# EAGLE design routed_anemo4 (EAGLE 6.6.0)
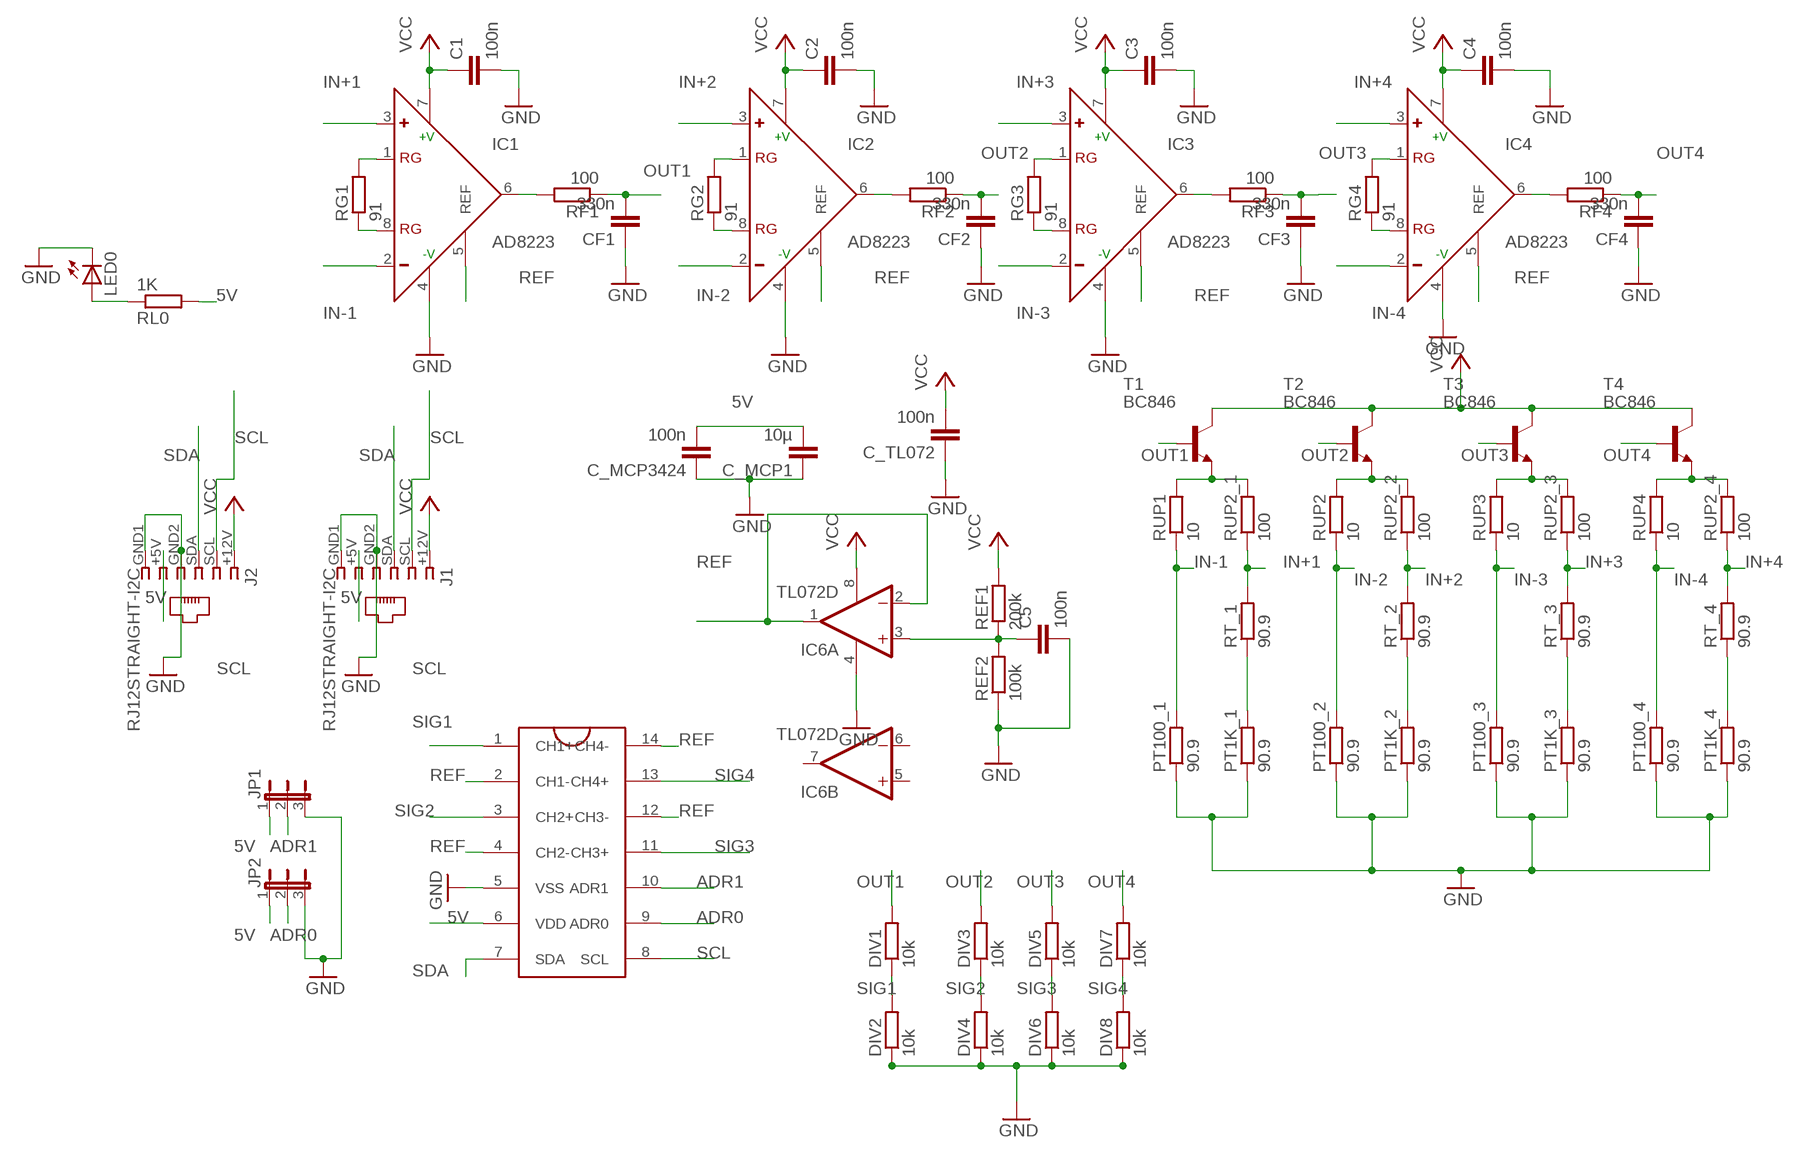
[diagram p0: schematic, sheet 1]

## Parts
C1  100n  C-EUC1206  [C1206]
C2  100n  C-EUC1206  [C1206]
C3  100n  C-EUC1206  [C1206]
C4  100n  C-EUC1206  [C1206]
C5  100n  C-EUC1206  [C1206]
C_MCP1  10µ  C-EUC1206  [C1206]
C_MCP3424  100n  C-EUC1206  [C1206]
C_TL072  100n  C-EUC1206  [C1206]
CF1  330n  C-EUC1206  [C1206]
CF2  330n  C-EUC1206  [C1206]
CF3  330n  C-EUC1206  [C1206]
CF4  330n  C-EUC1206  [C1206]
DIV1  10k  R-EU_M1206  [M1206]
DIV2  10k  R-EU_M1206  [M1206]
DIV3  10k  R-EU_M1206  [M1206]
DIV4  10k  R-EU_M1206  [M1206]
DIV5  10k  R-EU_M1206  [M1206]
DIV6  10k  R-EU_M1206  [M1206]
DIV7  10k  R-EU_M1206  [M1206]
DIV8  10k  R-EU_M1206  [M1206]
IC1  AD8223  AD620R  [SO8]
IC2  AD8223  AD620R  [SO8]
IC3  AD8223  AD620R  [SO8]
IC4  AD8223  AD620R  [SO8]
IC6  TL072D  [SO08]
J1  RJ12STRAIGHT-I2C  [RJ12-STRAIGHT-I2C]
J2  RJ12STRAIGHT-I2C  [RJ12-STRAIGHT-I2C]
JP1  JP2E  [JP2]
JP2  JP2E  [JP2]
LED0  LED1206  [LED-1206]
PT1K_1  90.9  R-EU_M1206  [M1206]
PT1K_2  90.9  R-EU_M1206  [M1206]
PT1K_3  90.9  R-EU_M1206  [M1206]
PT1K_4  90.9  R-EU_M1206  [M1206]
PT100_1  90.9  R-EU_M1206  [M1206]
PT100_2  90.9  R-EU_M1206  [M1206]
PT100_3  90.9  R-EU_M1206  [M1206]
PT100_4  90.9  R-EU_M1206  [M1206]
REF1  200k  R-EU_M1206  [M1206]
REF2  100k  R-EU_M1206  [M1206]
RF1  100  R-EU_M1206  [M1206]
RF2  100  R-EU_M1206  [M1206]
RF3  100  R-EU_M1206  [M1206]
RF4  100  R-EU_M1206  [M1206]
RG1  91  R-EU_M1206  [M1206]
RG2  91  R-EU_M1206  [M1206]
RG3  91  R-EU_M1206  [M1206]
RG4  91  R-EU_M1206  [M1206]
RL0  1K  R-EU_M1206  [M1206]
RT_1  90.9  R-EU_M1206  [M1206]
RT_2  90.9  R-EU_M1206  [M1206]
RT_3  90.9  R-EU_M1206  [M1206]
RT_4  90.9  R-EU_M1206  [M1206]
RUP1  10  R-EU_M1206  [M1206]
RUP2  10  R-EU_M1206  [M1206]
RUP2_1  100  R-EU_M1206  [M1206]
RUP2_2  100  R-EU_M1206  [M1206]
RUP2_3  100  R-EU_M1206  [M1206]
RUP2_4  100  R-EU_M1206  [M1206]
RUP3  10  R-EU_M1206  [M1206]
RUP4  10  R-EU_M1206  [M1206]
T1  BC846  [SOT23]
T2  BC846  [SOT23]
T3  BC846  [SOT23]
T4  BC846  [SOT23]
U$1  MCP3424(SO14)  [14LDSOIC]

## Nets
5V: C_MCP1.2 C_MCP3424.2 J1.+5V J2.+5V JP1.1 JP2.1 RL0.2 U$1.6(VDD)
ADR0: JP2.2 U$1.9(ADR0)
ADR1: JP1.2 U$1.10(ADR1)
GND [gnd]: C1.2 C2.2 C3.2 C4.2 C5.2 C_MCP1.1 C_MCP3424.1 C_TL072.1 CF1.1 CF2.1 CF3.1 CF4.1 DIV2.1 DIV4.1 DIV6.1 DIV8.1 IC1.4(-V) IC2.4(-V) IC3.4(-V) IC4.4(-V) IC6.4(P:V-) J1.GND1 J1.GND2 J2.GND1 J2.GND2 JP1.3 JP2.3 LED0.C PT1K_1.1 PT1K_2.1 PT1K_3.1 PT1K_4.1 PT100_1.1 PT100_2.1 PT100_3.1 PT100_4.1 REF2.1 U$1.5(VSS)
IN+1: IC1.3(+) RT_1.2 RUP2_1.1
IN+2: IC2.3(+) RT_2.2 RUP2_2.1
IN+3: IC3.3(+) RT_3.2 RUP2_3.1
IN+4: IC4.3(+) RT_4.2 RUP2_4.1
IN-1: IC1.2(-) PT100_1.2 RUP1.1
IN-2: IC2.2(-) PT100_2.2 RUP2.1
IN-3: IC3.2(-) PT100_3.2 RUP3.1
IN-4: IC4.2(-) PT100_4.2 RUP4.1
N$1: IC1.1(RG) RG1.2
N$2: IC1.8(RG) RG1.1
N$3: IC2.8(RG) RG2.1
N$4: IC2.1(RG) RG2.2
N$5: IC3.1(RG) RG3.2
N$6: IC3.8(RG) RG3.1
N$7: IC4.1(RG) RG4.2
N$8: IC4.8(RG) RG4.1
N$9: RUP1.2 RUP2_1.2 T1.2(E)
N$10: C5.1 IC6.3(A:+IN) REF1.1 REF2.2
N$11: RUP2.2 RUP2_2.2 T2.2(E)
N$12: RUP2_3.2 RUP3.2 T3.2(E)
N$13: RUP2_4.2 RUP4.2 T4.2(E)
N$14: LED0.A RL0.1
N$18: IC1.6(OUT) RF1.2
N$19: IC2.6(OUT) RF2.2
N$20: IC3.6(OUT) RF3.2
N$21: IC4.6(OUT) RF4.2
N$23: PT1K_1.2 RT_1.1
N$25: PT1K_2.2 RT_2.1
N$27: PT1K_3.2 RT_3.1
N$29: PT1K_4.2 RT_4.1
OUT1: CF1.2 DIV1.2 RF1.1 T1.1(B)
OUT2: CF2.2 DIV3.2 RF2.1 T2.1(B)
OUT3: CF3.2 DIV5.2 RF3.1 T3.1(B)
OUT4: CF4.2 DIV7.2 RF4.1 T4.1(B)
REF: IC1.5(REF) IC2.5(REF) IC3.5(REF) IC4.5(REF) IC6.1(A:OUT) IC6.2(A:-IN) U$1.2(CH1-) U$1.4(CH2-) U$1.12(CH3-) U$1.14(CH4-)
SCL: J1.SCL J2.SCL U$1.8(SCL)
SDA: J1.SDA J2.SDA U$1.7(SDA)
SIG1: DIV1.1 DIV2.2 U$1.1(CH1+)
SIG2: DIV3.1 DIV4.2 U$1.3(CH2+)
SIG3: DIV5.1 DIV6.2 U$1.11(CH3+)
SIG4: DIV7.1 DIV8.2 U$1.13(CH4+)
VCC: C1.1 C2.1 C3.1 C4.1 C_TL072.2 IC1.7(+V) IC2.7(+V) IC3.7(+V) IC4.7(+V) IC6.8(P:V+) J1.+12V J2.+12V REF1.2 T1.3(C) T2.3(C) T3.3(C) T4.3(C)
Unconnected: IC6.5(B:+IN) IC6.6(B:-IN) IC6.7(B:OUT)

## Library data of the parts
C1-C5 C_MCP1 C_MCP3424 C_TL072 CF1-CF4 = rcl:C-EU: CAPACITOR, European symbol
DIV1-DIV8 PT1K_1-PT1K_4 PT100_1-PT100_4 REF1 REF2 RF1-RF4 RG1-RG4 RL0 RT_1-RT_4 RUP1 RUP2 RUP2_1-RUP2_4 RUP3 RUP4 = resistor:R-EU_: RESISTOR, European symbol
IC1-IC4 = analog-devices:AD620: Low Cost, Low Power, Instrumentation Amplifier Source: http://www.analog.com/UploadedFiles/Data_Sheets/37793330023930AD620_e.pdf; MPN: AD620AR; OC_FARNELL: 1464424; OC_NEWARK: 05F7109
IC6 = linear:TL072: OP AMP
J1 J2 = lpatiny:RJ12: CORCOM Modular RJ Jacks No Shield Source: www.tycoelectronics.com .. ENG_DS_1654001_1099_RJ_L_0507.pdf
JP1 JP2 = jumper:JP2E: JUMPER
LED0 = SparkFun:LED: LEDs Standard schematic elements and footprints for 5mm, 3mm, 1206, and 0603 sized LEDs. 5mm - Spark Fun Electronics SKU : COM-00529 (and others)
T1-T4 = transistor:BC846: NPN TRANSISTOR
U$1 = mcp3424:MCP3424(SO14)

## Net classes
0 default: width 0.61 mm
1 gnd: width 0.61 mm
2 highpower: width 1.372 mm

## Board
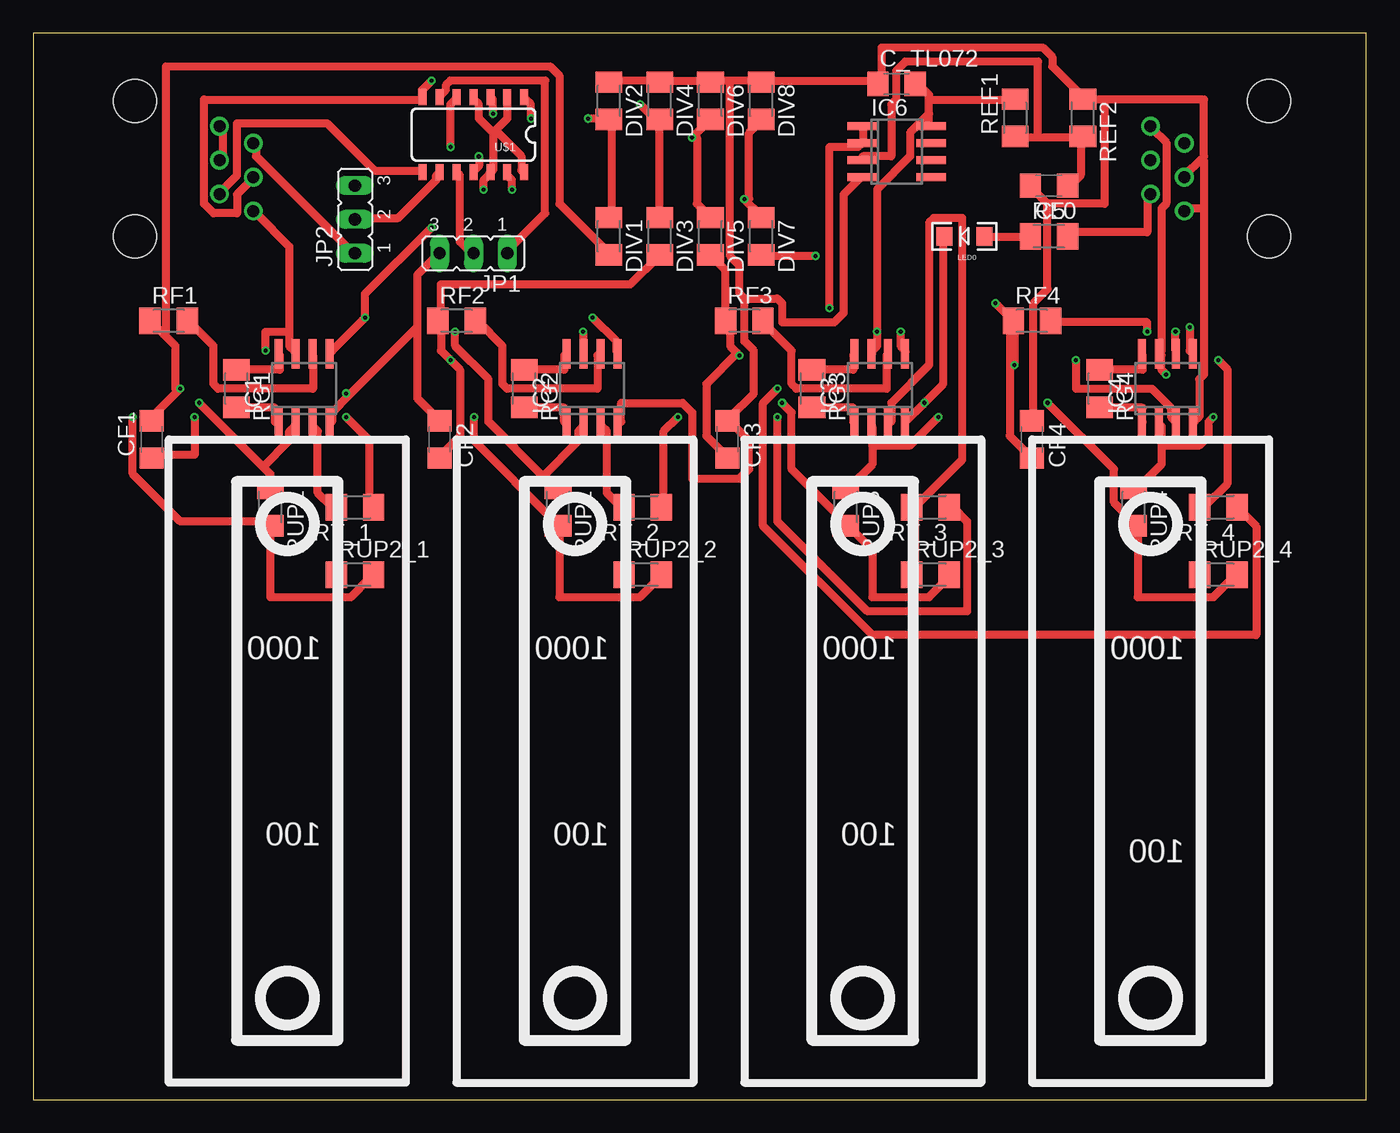
[diagram p1: board, top side]
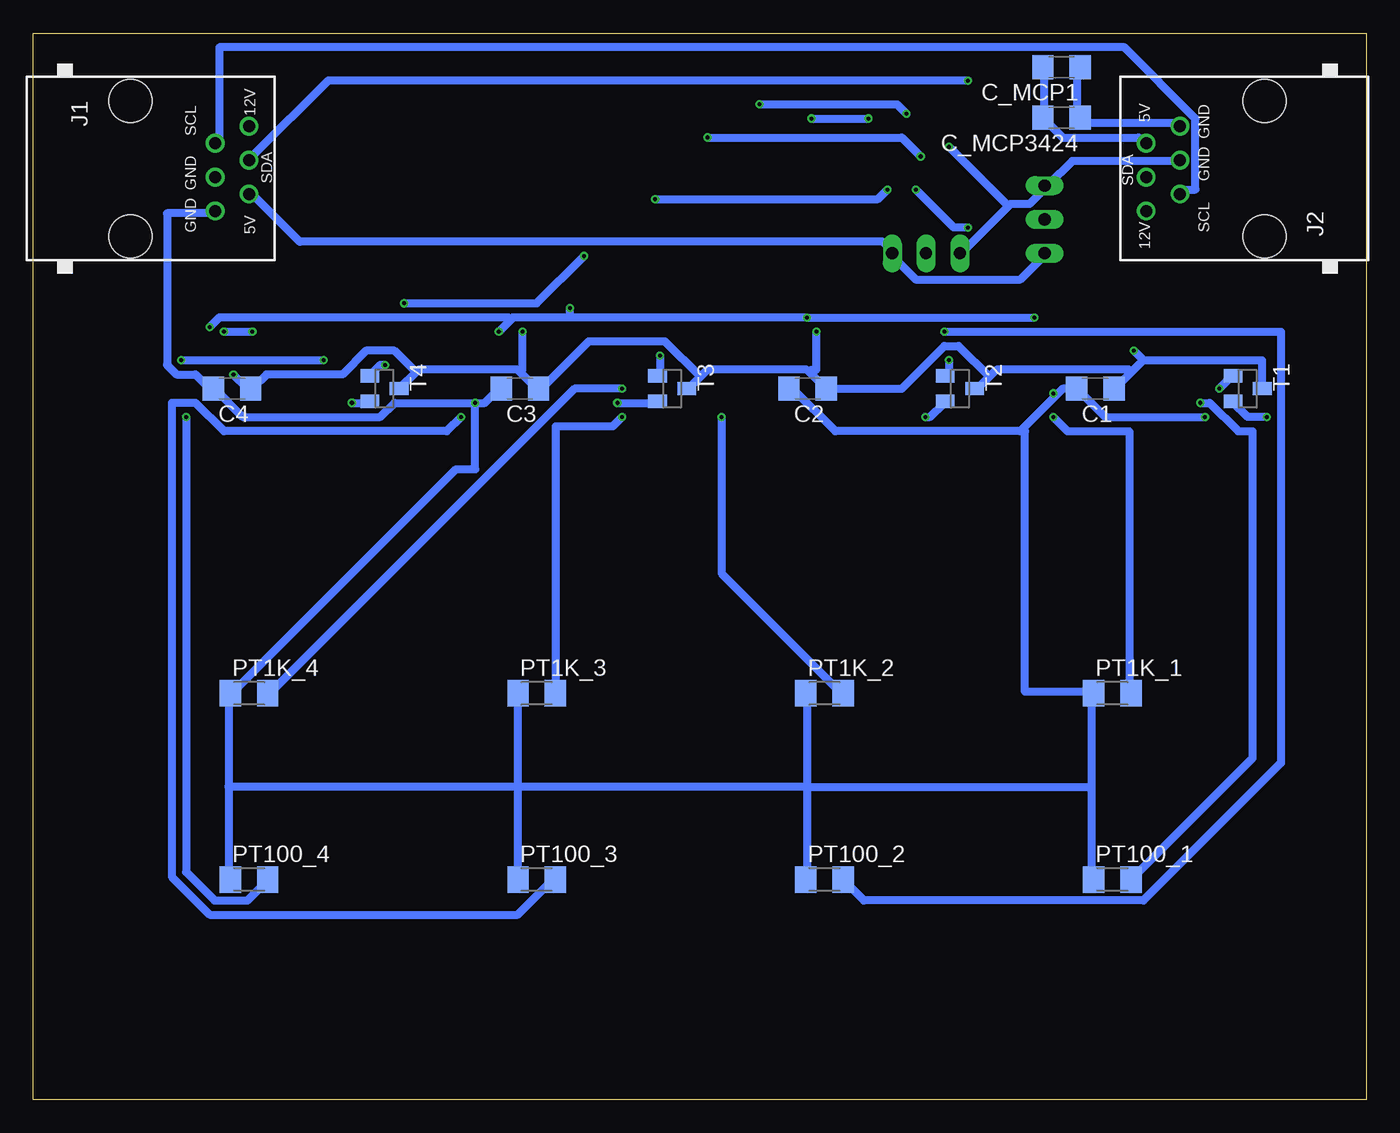
[diagram p2: board, bottom side, seen from below]

Size 100 x 80 mm. Coordinates in mm from the lower left corner, seen from the top.
Outline: 0,0 100,0 100,80 0,80 0,0
Copper layers (1*16): Top 0.035mm / dielectric 1.5mm / Bottom 0.035mm
Design rules "Fusion_eagle_rule_v1.1": minimum track width 6mil, minimum drill 12mil, track to track 6mil, track to pad 6mil, pad to pad 6mil, via to via 6mil, smd to smd 0mil, copper to edge 10mil, drill to drill 10mil, minimum pad ring 10mil, minimum via ring 6mil, stop-mask expansion 2mil, vias tented up to drill 100mil, thermal gap 10mil
vRestrict: area -2.5,-1.3 to 102.9,50.8

### Footprints (pad centres in the part's own frame; a part is rotated, then mirrored left to right if it is on the bottom)
C1206 = smd 1.6 x 1.8: 1 -1.4,0; 2 1.4,0
M1206 = smd 1.6 x 2: 1 -1.4,0; 2 1.4,0
SO8 = smd 0.6 x 2.2: 1 -1.905,-2.6; 2 -0.635,-2.6; 3 0.635,-2.6; 4 1.905,-2.6; 5 1.905,2.6; 6 0.635,2.6; 7 -0.635,2.6; 8 -1.905,2.6
SO08 = smd 0.6 x 2.2: 1 -1.905,-2.6; 2 -0.635,-2.6; 3 0.635,-2.6; 4 1.905,-2.6; 5 1.905,2.6; 6 0.635,2.6; 7 -0.635,2.6; 8 -1.905,2.6
RJ12-STRAIGHT-I2C = drill 0.9 pad 1.4: +5V 1.905,8.89; +12V -3.175,8.89; GND1 3.175,6.35; GND2 0.635,6.35; SCL -1.905,6.35; SDA -0.635,8.89 | hole 3.251: -5.08,0; 5.08,0
JP2 = drill 0.914 long: 1 -2.54,0; 2 0,0; 3 2.54,0
LED-1206 = smd 1.2 x 1.4: A -1.5,0; C 1.5,0
SOT23 = smd 1 x 1.4: 1 -0.95,-1.1; 2 0.95,-1.1; 3 0,1.1
14LDSOIC = smd 1.2 x 0.6: 1 -2.8,3.81; 2 -2.8,2.54; 3 -2.8,1.27; 4 -2.8,0; 5 -2.8,-1.27; 6 -2.8,-2.54; 7 -2.8,-3.81; 8 2.8,-3.81; 9 2.8,-2.54; 10 2.8,-1.27; 11 2.8,0; 12 2.8,1.27; 13 2.8,2.54; 14 2.8,3.81

### Placement (x,y rotation side)
C1  20.32,53.34 180 bottom
C2  41.91,53.34 180 bottom
C3  63.5,53.34 180 bottom
C4  85.09,53.34 180 bottom
C5  76.2,68.58 180 top
C_MCP1  22.86,77.47 180 bottom
C_MCP3424  22.86,73.66 180 bottom
C_TL072  64.77,76.2 0 top
CF1  8.89,49.53 90 top
CF2  30.48,49.53 270 top
CF3  52.07,49.53 270 top
CF4  74.93,49.53 270 top
DIV1  43.18,64.77 270 top
DIV2  43.18,74.93 270 top
DIV3  46.99,64.77 270 top
DIV4  46.99,74.93 270 top
DIV5  50.8,64.77 270 top
DIV6  50.8,74.93 270 top
DIV7  54.61,64.77 270 top
DIV8  54.61,74.93 270 top
IC1  20.32,53.34 0 top
IC2  41.91,53.34 0 top
IC3  63.5,53.34 0 top
IC4  85.09,53.34 0 top
IC6  64.77,71.12 270 top
J1  92.71,69.85 270 bottom
J2  7.62,69.85 90 bottom
JP1  33.02,63.5 180 top
JP2  24.13,66.04 90 top
LED0  69.85,64.77 180 top
PT1K_1  19.05,30.48 0 bottom
PT1K_2  40.64,30.48 0 bottom
PT1K_3  62.23,30.48 0 bottom
PT1K_4  83.82,30.48 0 bottom
PT100_1  19.05,16.51 0 bottom
PT100_2  40.64,16.51 0 bottom
PT100_3  62.23,16.51 0 bottom
PT100_4  83.82,16.51 0 bottom
REF1  73.66,73.66 90 top
REF2  78.74,73.66 270 top
RF1  10.16,58.42 0 top
RF2  31.75,58.42 0 top
RF3  53.34,58.42 0 top
RF4  74.93,58.42 0 top
RG1  15.24,53.34 270 top
RG2  36.83,53.34 270 top
RG3  58.42,53.34 270 top
RG4  80.01,53.34 270 top
RL0  76.2,64.77 0 top
RT_1  24.13,44.45 180 top
RT_2  45.72,44.45 180 top
RT_3  67.31,44.45 180 top
RT_4  88.9,44.45 180 top
RUP1  17.78,44.45 270 top
RUP2  39.37,44.45 270 top
RUP2_1  24.13,39.37 0 top
RUP2_2  45.72,39.37 0 top
RUP2_3  67.31,39.37 0 top
RUP2_4  88.9,39.37 0 top
RUP3  60.96,44.45 270 top
RUP4  82.55,44.45 270 top
T1  8.89,53.34 270 bottom
T2  30.48,53.34 270 bottom
T3  52.07,53.34 270 bottom
T4  73.66,53.34 270 bottom
U$1  33.02,72.39 270 top

### Tracks (layer width: path | path; a pad name or v marks a point on that pad's centre or on a via)
5V
  Top 0.61: JP2.1 23.82,63.65 16.71,70.76 16.71,71.48 J2.+5V | RL0.2 77.88,65.08 83.57,65.08 83.57,67.92 J1.+5V | U$1.6 30.58,75.39 30.94,75.74 30.94,76.1 31.29,76.45 38.41,76.45 38.41,66.5 35.56,63.65 JP1.1
  Bottom 0.61: C_MCP1.2 24.18,77.17 24.18,73.97 C_MCP3424.2 24.18,73.61 22.76,72.19 17.07,72.19 16.71,71.83 J2.+5V | J1.+5V 83.57,67.92 80.01,64.36 36.27,64.36 35.56,63.65 JP1.1 35.56,63.3 33.78,61.52 25.96,61.52 24.18,63.3 JP2.1
ADR0
  Top 0.61: U$1.9 30.23,69.34 30.23,68.99 27.38,66.14 24.18,66.14 JP2.2
ADR1
  Top 0.61: U$1.10 32,69.34 32,64.36 32.72,63.65 JP1.2
GND  (via drill 0.3)
  Top 0.61: LED0.C 68.28,64.72 68.28,53.7 v66.85,52.27 65.43,50.85 IC3.4 | 76.1,67.21 75.03,68.28 C5.2 | 76.1,67.21 76.1,60.81 75.03,59.74 75.03,51.21 CF4.1 | 80.37,75.03 87.83,75.03 87.83,70.76 87.66,70.59 | 80.37,75.03 78.94,75.03 REF2.1 78.59,75.39 76.45,77.52 76.45,78.23 75.74,78.94 63.65,78.94 63.65,76.45 C_TL072.1 63.3,76.45 54.76,76.45 DIV8.1 54.41,76.45 52.27,76.45 | 87.66,70.59 86.41,69.34 J1.GND2 | 87.83,66.85 87.83,70.41 87.66,70.59 | 87.83,66.85 87.83,54.41 87.48,54.05 87.48,51.21 87.12,50.85 IC4.4 | 87.83,66.85 86.41,66.85 J1.GND1 | 76.1,67.21 80.37,67.21 80.37,75.03 | DIV2.1 43.38,76.45 46.94,76.45 DIV4.1 47.3,76.45 50.49,76.45 DIV6.1 50.85,76.45 52.27,76.45 | IC2.4 44.09,50.85 44.09,52.27 48.72,52.27 49.43,51.56 49.43,46.58 52.98,46.58 53.7,47.3 53.7,49.43 52.27,50.85 CF3.1 52.27,51.21 54.05,52.98 54.05,56.19 53.34,56.9 53.34,60.1 | 53.34,60.1 55.83,60.1 56.19,59.74 56.19,58.32 60.1,58.32 60.81,59.03 60.81,67.92 61.87,68.99 IC6.4 | 52.27,76.45 52.27,63.3 52.98,62.59 52.98,60.45 53.34,60.1 | J2.GND2 14.22,70.76 14.22,72.9 J2.GND1 | 28.8,57.96 28.8,61.87 30.23,63.3 JP1.3 | 28.8,57.96 28.8,52.63 30.23,51.21 CF2.1 | 28.8,57.96 23.65,52.81 | 23.65,52.81 22.4,51.56 22.4,50.85 IC1.4 | v12.09,51.21 12.09,48.36 8.89,48.36 CF1.1 | v23.47,52.98 23.65,52.81 | v31.29,71.48 31.29,74.68 31.65,75.03 U$1.5
  Bottom 0.61: v66.85,52.27 72.9,52.27 73.97,51.21 84.28,51.21 86.41,53.34 C4.2 86.77,53.34 87.83,54.41 89.26,54.41 89.97,55.12 89.97,66.5 86.41,66.5 J1.GND1 | v66.85,52.27 66.14,52.27 65.08,53.34 C3.2 | C_MCP1.1 21.69,77.17 21.69,73.97 C_MCP3424.1 21.34,73.61 20.98,73.25 14.22,73.25 J2.GND1 | J2.GND2 14.22,70.41 22.05,70.41 23.82,68.63 JP2.3 24.18,68.28 25.25,67.21 26.67,67.21 26.85,67.03 | 26.85,67.03 30.23,63.65 JP1.3 | v12.09,51.21 19.56,51.21 21.69,53.34 C1.2 22.76,53.34 23.29,52.81 | 23.29,52.81 25.78,50.32 | 25.78,50.32 25.96,50.14 39.83,50.14 43.03,53.34 C2.2 | 85.34,23.47 85.34,30.23 PT1K_4.1 84.99,30.58 68.28,47.3 66.85,47.3 v66.85,52.27 | 85.34,23.47 85.34,16.71 PT100_4.1 | 63.65,23.47 63.65,30.23 PT1K_3.1 | 63.65,23.47 63.65,16.71 PT100_3.1 | 20.62,23.47 20.62,30.23 PT1K_1.1 20.62,30.58 25.6,30.58 25.6,50.14 25.78,50.32 | 20.62,23.47 20.62,16.71 PT100_1.1 | 41.96,23.47 41.96,30.23 PT1K_2.1 | 41.96,23.47 41.96,16.71 PT100_2.1 | 41.96,23.47 20.62,23.47 | 41.96,23.47 63.65,23.47 | 63.65,23.47 85.34,23.47 | v23.47,52.98 23.29,52.81 | 26.85,67.03 v31.29,71.48
IN+1
  Top 0.61: RUP2_1.1 22.76,39.47 22.76,44.45 RT_1.2 22.4,44.45 21.34,45.52 21.34,50.14 20.98,50.49 IC1.3
IN+2
  Top 0.61: RUP2_2.1 44.45,39.47 44.45,44.45 RT_2.2 44.09,44.45 43.03,45.52 43.03,50.14 42.67,50.49 IC2.3
IN+3
  Top 0.61: 66.14,44.45 66.14,39.47 RUP2_3.1 | 66.14,44.45 69.7,48.01 69.7,66.14 67.56,66.14 67.21,65.79 67.21,55.12 64.36,52.27 64.36,50.85 IC3.3 | 66.14,44.45 RT_3.2
IN+4  (via drill 0.3)
  Top 0.61: RUP2_4.1 87.48,39.47 87.48,44.45 RT_4.2 87.83,44.45 89.61,46.23 89.61,54.76 v88.9,55.47 | v78.23,55.47 78.23,53.34 83.92,53.34 85.34,51.92 85.34,51.21 85.7,50.85 IC4.3
  Bottom 0.61: v88.9,55.47 v78.23,55.47
IN-1  (via drill 0.3)
  Top 0.61: 17.25,47.47 17.78,46.94 RUP1.1 | 17.25,47.47 v12.45,52.27 | 17.25,47.47 19.2,49.43 19.2,50.14 19.56,50.49 IC1.2
  Bottom 0.61: v12.45,52.27 11.73,52.27 9.6,50.14 8.53,50.14 8.53,25.6 17.42,16.71 PT100_1.2
IN-2  (via drill 0.3)
  Top 0.61: v31.65,57.61 31.65,56.54 34.14,54.05 34.14,50.85 38.23,46.76 | 38.23,46.76 39.12,45.87 RUP2.1 | 38.23,46.76 40.89,49.43 40.89,50.14 41.25,50.49 IC2.2
  Bottom 0.61: v31.65,57.61 6.4,57.61 6.4,25.25 16.71,14.94 37.69,14.94 39.12,16.36 PT100_2.2
IN-3  (via drill 0.3)
  Top 0.61: v67.92,51.21 65.79,49.07 62.94,49.07 | 62.94,49.07 62.94,50.49 IC3.2 | 62.94,49.07 62.94,47.65 61.16,45.87 RUP3.1
  Bottom 0.61: v67.92,51.21 68.99,50.14 85.7,50.14 87.83,52.27 89.61,52.27 89.61,16.71 86.77,13.87 63.65,13.87 61.16,16.36 PT100_3.2
IN-4  (via drill 0.3)
  Top 0.61: v88.54,51.21 88.19,50.85 88.19,49.78 87.48,49.07 84.63,49.07 | 84.63,49.07 84.63,50.49 IC4.2 | 84.63,49.07 84.63,47.65 82.86,45.87 RUP4.1
  Bottom 0.61: v88.54,51.21 88.54,17.07 86.41,14.94 83.92,14.94 82.5,16.36 PT100_4.2
N$1
  Top 0.61: RG1.2 15.29,51.92 18.14,51.92 18.14,50.85 IC1.1
N$2
  Top 0.61: RG1.1 15.29,54.76 18.49,54.76 18.49,55.83 IC1.8
N$3
  Top 0.61: RG2.1 36.98,54.76 39.83,54.76 39.83,55.83 IC2.8
N$4
  Top 0.61: RG2.2 36.98,51.92 39.83,51.92 39.83,50.85 IC2.1
N$5
  Top 0.61: RG3.2 58.67,51.92 61.52,51.92 61.52,50.85 IC3.1
N$6
  Top 0.61: RG3.1 58.67,54.76 61.52,54.76 61.52,55.83 IC3.8
N$7
  Top 0.61: RG4.2 80.01,51.92 83.21,51.92 83.21,50.85 IC4.1
N$8
  Top 0.61: RG4.1 80.01,54.76 83.21,54.76 83.21,55.83 IC4.8
N$9  (via drill 0.3)
  Top 0.61: v7.47,51.21 7.47,46.94 11.02,43.38 17.78,43.38 RUP1.2 17.78,37.69 23.82,37.69 25.25,39.12 RUP2_1.2
  Bottom 0.61: v7.47,51.21 8.89,51.21 9.96,52.27 T1.2
N$10
  Top 0.61: 78.59,72.19 78.59,69.34 77.88,68.63 C5.1 | 78.59,72.19 75.39,72.19 | 75.39,72.19 73.97,72.19 REF1.1 | 78.59,72.19 REF2.2 | 75.39,72.19 75.39,77.88 65.43,77.88 64.72,77.17 64.72,75.03 64.36,74.68 64.36,70.76 62.23,70.76 IC6.3
N$11  (via drill 0.3)
  Top 0.61: v33.07,51.21 33.07,49.43 39.12,43.38 RUP2.2 39.47,43.03 39.47,37.69 45.52,37.69 46.94,39.12 RUP2_2.2
  Bottom 0.61: v33.07,51.21 32.72,51.21 31.65,52.27 T2.2
N$12  (via drill 0.3)
  Top 0.61: v56.19,52.27 56.9,51.56 56.9,47.3 60.81,43.38 RUP3.2 61.16,43.03 62.94,41.25 62.94,37.69 67.21,37.69 68.63,39.12 RUP2_3.2
  Bottom 0.61: v56.19,52.27 53.34,52.27 T3.2
N$13  (via drill 0.3)
  Top 0.61: v76.1,52.27 81.08,47.3 81.08,44.81 82.5,43.38 RUP4.2 82.86,43.03 82.86,37.69 88.54,37.69 89.97,39.12 RUP2_4.2
  Bottom 0.61: v76.1,52.27 75.03,52.27 T4.2
N$14
  Top 0.61: LED0.A 71.48,64.72 74.68,64.72 RL0.1
N$18
  Top 0.61: RF1.2 11.73,58.32 13.51,56.54 13.51,53.7 13.87,53.34 20.98,53.34 20.98,55.83 IC1.6
N$19
  Top 0.61: RF2.2 33.43,58.32 35.2,56.54 35.2,53.7 35.56,53.34 42.32,53.34 42.32,55.83 IC2.6
N$20
  Top 0.61: RF3.2 54.76,58.32 56.9,56.19 56.9,53.7 57.25,53.34 64.01,53.34 64.01,55.83 IC3.6
N$21  (via drill 0.3)
  Top 0.61: v83.57,57.61 83.57,58.32 76.45,58.32 RF4.2 | v85.7,57.61 85.7,56.19 IC4.6
  Bottom 0.61: v85.7,57.61 v83.57,57.61
N$23  (via drill 0.3)
  Top 0.61: v23.47,51.21 25.25,49.43 25.25,44.45 RT_1.1
  Bottom 0.61: v23.47,51.21 22.4,50.14 17.78,50.14 17.78,30.58 PT1K_1.2
N$25  (via drill 0.3)
  Top 0.61: v48.36,51.21 47.3,50.14 47.3,44.45 RT_2.1
  Bottom 0.61: v48.36,51.21 48.36,39.47 39.47,30.58 PT1K_2.2
N$27  (via drill 0.3)
  Top 0.61: v55.83,51.21 55.83,43.38 62.59,36.63 70.05,36.63 70.05,43.38 68.99,44.45 RT_3.1
  Bottom 0.61: v55.83,51.21 56.54,50.49 60.81,50.49 60.81,30.58 PT1K_3.2
N$29  (via drill 0.3)
  Top 0.61: v55.83,53.34 54.76,52.27 54.76,43.03 62.94,34.85 91.75,34.85 91.75,43.03 90.32,44.45 RT_4.1
  Bottom 0.61: v55.83,53.34 59.38,53.34 82.14,30.58 PT1K_4.2
OUT1  (via drill 0.3)
  Top 0.61: 10.85,53.16 8.89,51.21 CF1.2 | 10.85,53.16 v11.02,53.34 | 9.78,57.43 10.67,56.54 10.67,53.34 10.85,53.16 | 9.78,57.43 8.89,58.32 RF1.1 | DIV1.2 43.03,63.65 39.47,67.21 39.47,76.81 38.76,77.52 9.96,77.52 9.96,57.61 9.78,57.43
  Bottom 0.61: v11.02,53.34 10.31,54.05 T1.1
OUT2  (via drill 0.3)
  Top 0.61: CF2.2 30.58,48.36 32,49.78 32,54.76 v31.29,55.47 30.58,56.19 30.58,58.32 RF2.1 30.58,58.67 30.58,61.16 44.81,61.16 46.94,63.3 DIV3.2
  Bottom 0.61: v31.29,55.47 31.29,54.41 T2.1
OUT3  (via drill 0.3)
  Top 0.61: 52.81,56.01 52.27,56.54 52.27,58.32 RF3.1 51.92,58.67 51.92,62.23 50.85,63.3 DIV5.2 | 52.81,56.01 v52.98,55.83 | 52.81,56.01 50.49,53.7 50.49,49.78 51.92,48.36 CF3.2
  Bottom 0.61: v52.98,55.83 52.98,54.41 T3.1
OUT4  (via drill 0.3)
  Top 0.61: v73.61,55.12 73.61,58.32 RF4.1 | CF4.2 74.68,48.36 73.25,49.78 73.25,58.32 RF4.1 | v58.67,63.3 54.76,63.3 DIV7.2 | v72.19,59.74 73.25,58.67 RF4.1
  Bottom 0.61: v73.61,55.12 73.97,55.12 74.68,54.41 T4.1 | v58.67,63.3 62.23,59.74 v72.19,59.74
REF  (via drill 0.3)
  Top 0.61: IC6.1 62.23,72.9 62.23,71.83 IC6.2 61.87,71.48 59.74,71.48 v59.74,59.38 | v41.96,58.67 43.74,56.9 43.74,56.19 IC2.5 | IC1.5 22.4,56.19 v24.89,58.67 24.89,60.45 v29.87,65.43 | v65.08,57.61 65.08,56.54 65.43,56.19 IC3.5 | v86.77,57.96 86.77,56.19 IC4.5 | 34.49,72.54 34.49,69.7 U$1.12 34.14,69.34 33.78,68.99 v33.78,68.28 | 34.67,72.72 35.56,73.61 U$1.2 | 34.67,72.72 34.49,72.54 | 34.49,72.54 33.43,73.61 33.43,74.68 33.07,75.03 U$1.4 | 34.67,72.72 36.63,70.76 36.63,69.7 U$1.14
  Bottom 0.61: v24.89,58.67 v41.96,58.67 59.74,58.67 | 64.19,58.5 64.01,58.67 59.74,58.67 | 64.19,58.5 v65.08,57.61 | v86.77,57.96 86.06,58.67 64.36,58.67 64.19,58.5 | 59.74,58.67 v59.74,59.38 | v33.78,68.28 30.94,65.43 v29.87,65.43
SCL
  Top 0.61: U$1.8 29.16,69.7 25.6,69.7 22.05,73.25 15.29,73.25 15.29,69.34 14.22,68.28 J2.SCL
  Bottom 0.61: J1.SCL 86.06,71.83 86.06,78.94 18.14,78.94 12.8,73.61 12.8,68.28 13.87,68.28 J2.SCL
SDA  (via drill 0.3)
  Top 0.61: J2.SDA 16.36,68.99 15.29,67.92 15.29,66.5 13.51,66.5 12.8,67.21 12.8,75.03 29.16,75.03 U$1.7 29.16,75.39 29.16,75.74 v29.87,76.45
  Bottom 0.61: v29.87,76.45 77.88,76.45 83.57,70.76 J1.SDA
SIG1  (via drill 0.3)
  Top 0.61: v37.34,73.61 37.34,74.68 36.98,75.03 U$1.1 | v41.6,73.61 43.03,73.61 DIV2.2 43.38,73.25 43.38,66.5 DIV1.1
  Bottom 0.61: v41.6,73.61 v37.34,73.61
SIG2  (via drill 0.3)
  Top 0.61: v34.49,73.97 34.49,75.03 U$1.3 | 46.94,73.25 v45.52,74.68 | 46.94,73.25 46.94,66.5 DIV3.1 | 46.94,73.25 DIV4.2
  Bottom 0.61: v34.49,73.97 35.2,74.68 v45.52,74.68
SIG3  (via drill 0.3)
  Top 0.61: v33.43,70.76 33.43,70.05 33.07,69.7 U$1.11 | 49.61,72.36 50.49,73.25 DIV6.2 | 49.61,72.36 v49.43,72.19 | DIV5.1 50.49,66.5 49.78,67.21 49.78,72.19 49.61,72.36
  Bottom 0.61: v33.43,70.76 34.85,72.19 v49.43,72.19
SIG4  (via drill 0.3)
  Top 0.61: v35.92,68.28 35.92,68.99 35.56,69.34 U$1.13 | 53.52,67.39 54.41,66.5 DIV7.1 | 53.52,67.39 v53.34,67.56 | DIV8.2 54.41,73.25 53.7,72.54 53.7,67.56 53.52,67.39
  Bottom 0.61: v35.92,68.28 36.63,67.56 v53.34,67.56
VCC  (via drill 0.3)
  Top 0.61: 19.2,57.61 19.2,64.01 16.71,66.5 J2.+12V | 19.2,57.61 19.2,56.54 19.56,56.19 IC1.7 | 19.2,57.61 17.42,57.61 v17.42,56.19 | 67.21,73.97 67.21,73.25 IC6.8 | 67.21,73.97 67.21,75.03 | 67.21,75.03 67.21,75.39 66.5,76.1 C_TL072.2 | 67.21,75.03 73.61,75.03 REF1.2 | 67.21,73.97 65.79,72.54 65.79,70.76 63.3,68.28 v63.3,57.61 63.3,56.54 62.94,56.19 IC3.7 | J1.+12V 83.92,72.9 84.99,71.83 84.99,67.21 84.63,66.85 84.63,56.19 IC4.7 84.63,55.83 84.63,54.76 v84.99,54.41 | v41.25,57.61 41.25,56.19 IC2.7
  Bottom 0.61: 16.71,55.47 7.82,55.47 7.82,53.34 T1.3 | 17.6,54.59 18.85,53.34 C1.1 | 17.6,54.59 16.71,55.47 | 28.27,54.23 27.74,54.76 17.78,54.76 17.6,54.59 | 28.27,54.23 29.16,53.34 T2.3 | 16.71,55.47 v17.42,56.19 | 49.96,54.23 49.43,54.76 41.96,54.76 41.78,54.59 | 49.96,54.23 50.85,53.34 T3.3 | 41.78,54.59 40.54,53.34 C2.1 34.85,53.34 31.65,56.54 30.58,56.54 28.27,54.23 | v41.25,57.61 41.25,54.76 41.6,54.76 41.78,54.59 | 71.3,54.59 71.12,54.76 63.65,54.76 63.48,54.59 | 71.3,54.59 72.54,53.34 T4.3 | 63.48,54.59 62.23,53.34 C3.1 61.87,53.34 58.32,56.9 52.63,56.9 49.96,54.23 | 71.3,54.59 72.9,56.19 75.03,56.19 76.81,54.41 82.5,54.41 83.57,53.34 C4.1 83.92,53.34 v84.99,54.41 | v63.3,57.61 63.3,54.76 63.48,54.59

### Text on the board
_tsilk: 1000 | 1000 | 1000 | 1000 | 100 | 100 | 100 | 100